# Altium schematic sheet Sheet1.SchDoc
size A3; SheetNumber: 1; SheetTotal: 1
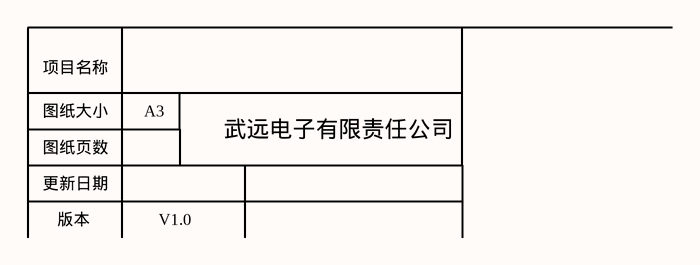
[diagram p0: Sheet1.SchDoc]

## Notes on the sheet
- 项目名称
- 图纸大小
- A3
- 更新日期
- 图纸页数
- 武远电子有限责任公司
- 版本
- V1.0